# EAGLE design Camera_board (EAGLE 6.5.0)
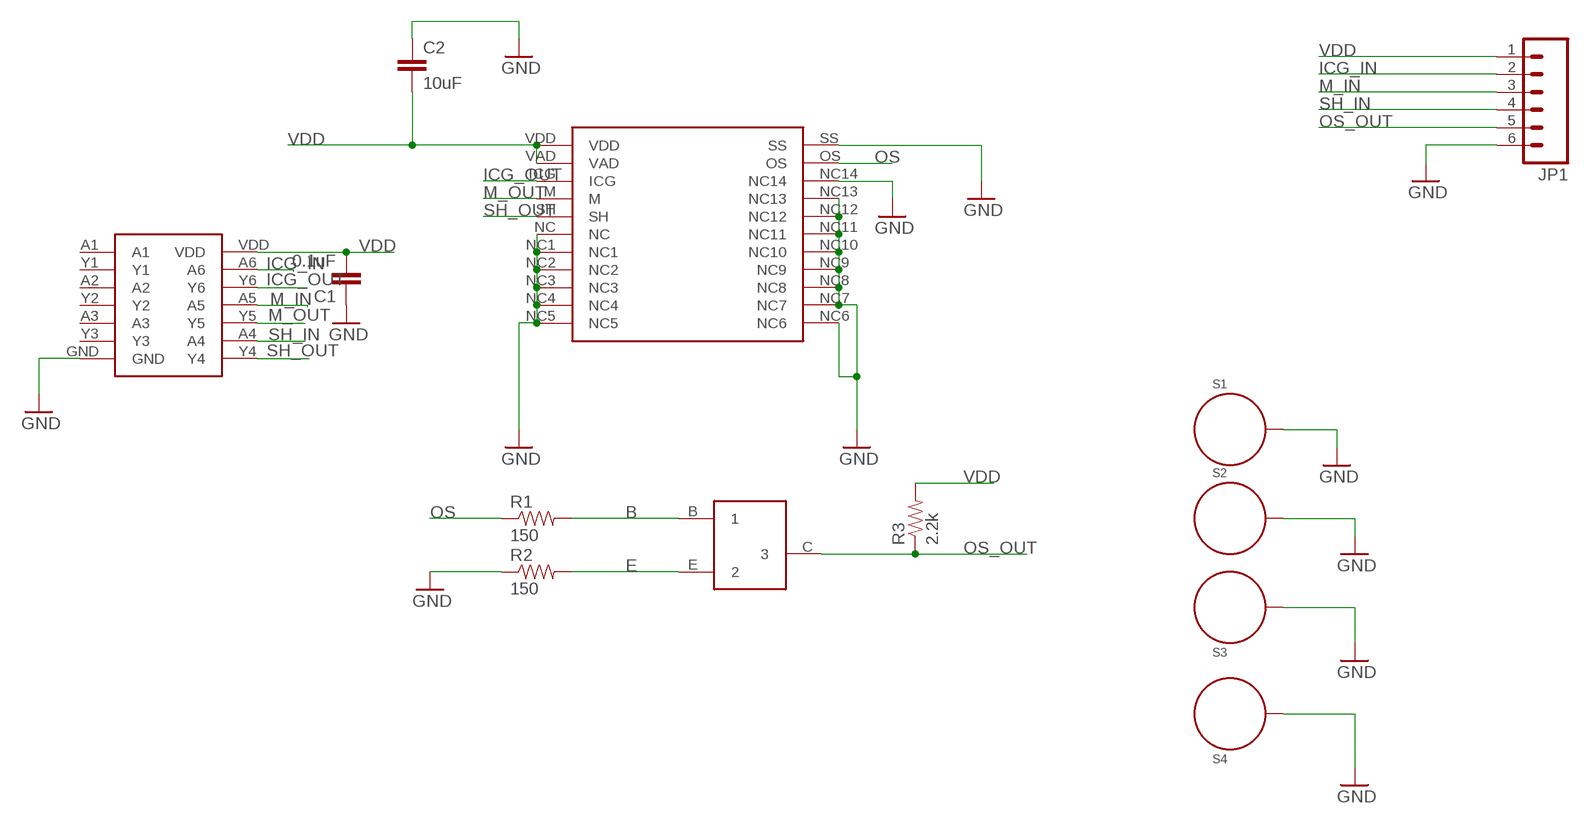
[diagram p0: schematic, sheet 1]

## Parts
C1  0.1uF  CAP1206  [1206]
C2  10uF  CAP1206  [1206]
JP1  M06POLAR  [MOLEX-1X6]
R1  150  RESISTOR1206  [1206]
R2  150  RESISTOR1206  [1206]
R3  2.2k  RESISTOR1206  [1206]
S1  STANDOFF_ELECTRICAL  [STANDOFF-ELECTRICAL]
S2  STANDOFF_ELECTRICAL  [STANDOFF-ELECTRICAL]
S3  STANDOFF_ELECTRICAL  [STANDOFF-ELECTRICAL]
S4  STANDOFF_ELECTRICAL  [STANDOFF-ELECTRICAL]
U$1  TRANSISTOR  [SOT23-BEC]
U$2  CCDCAMERA  [CCDCAMERA]
U$3  CMOS_HEX_INVERTER  [CMOS_HEX_INVERTER]

## Nets
B: R1.2 U$1.B
E: R2.2 U$1.E
GND: C1.1 C2.1 JP1.6 R2.1 S1.P1 S2.P1 S3.P1 S4.P1 U$2.NC U$2.NC1 U$2.NC2 U$2.NC3 U$2.NC4 U$2.NC5 U$2.NC6 U$2.NC7 U$2.NC8 U$2.NC9 U$2.NC10 U$2.NC11 U$2.NC12 U$2.NC13 U$2.NC14 U$2.SS U$3.GND
ICG_IN: JP1.2 U$3.A6
ICG_OUT: U$2.ICG U$3.Y6
M_IN: JP1.3 U$3.A5
M_OUT: U$2.M U$3.Y5
OS: R1.1 U$2.OS
OS_OUT: JP1.5 R3.1 U$1.C
SH_IN: JP1.4 U$3.A4
SH_OUT: U$2.SH U$3.Y4
VDD: C1.2 C2.2 JP1.1 R3.2 U$2.VAD U$2.VDD U$3.VDD
Unconnected: U$3.A1 U$3.A2 U$3.A3 U$3.Y1 U$3.Y2 U$3.Y3

## Library data of the parts
C1 C2 = SparkFun-Capacitors:CAP: Capacitor Standard 0603 ceramic capacitor, and 0.1" leaded capacitor.
JP1 = SparkFun-Connectors:M06: Header 6 Standard 6-pin 0.1" header. Use with straight break away headers (SKU : PRT-00116), right angle break away headers (PRT-00553), swiss pins (PRT-00743), machine pins (PRT-00117), and female headers (PRT-00115). Molex polarized connector foot print use with SKU : PRT-08094 with associated crimp pins and housings. NOTES ON THE VARIANTS LOCK and LOCK_LONGPADS... This footprint was designed to help hold the alignment of a through-hole component (i.e. 6-pin header) while soldering it into place. You may notice that each hole has been shifted either up or down by 0.005 of an inch from it's more standard position (which is a perfectly straight line). This slight alteration caused the pins (the squares in the middle) to touch the edges of the holes. Because they are alternating, it causes a "brace" to hold the component in place. 0.005 has proven to be the perfect amount of "off-center" position when using our standard breakaway headers. Although looks a little odd when you look at the bare footprint, once you have a header in there, the alteration is very hard to notice. Also,if you push a header all the way into place, it is covered up entirely on the bottom side. This idea of altering the position of holes to aid alignment will be further integrated into the Sparkfun Library for other footprints. It can help hold any component with 3 or more connection pins.
R1-R3 = SparkFun-Resistors:RESISTOR: Resistor Basic schematic elements and footprints for 0603, 1206, and PTH resistors.
S1-S4 = SparkFun-Electromechanical:STANDOFF_ELECTRICAL: A standoff intended to be an electrically connected point. Pad size and stop size allow for a #4 Phillips pan screw head to make a solid connection to the board.
U$1 = SCIENCE_BOARD:TRANSISTOR
U$2 = SCIENCE_BOARD:CCDCAMERA
U$3 = SCIENCE_BOARD:CMOS_HEX_INVERTER

## Board
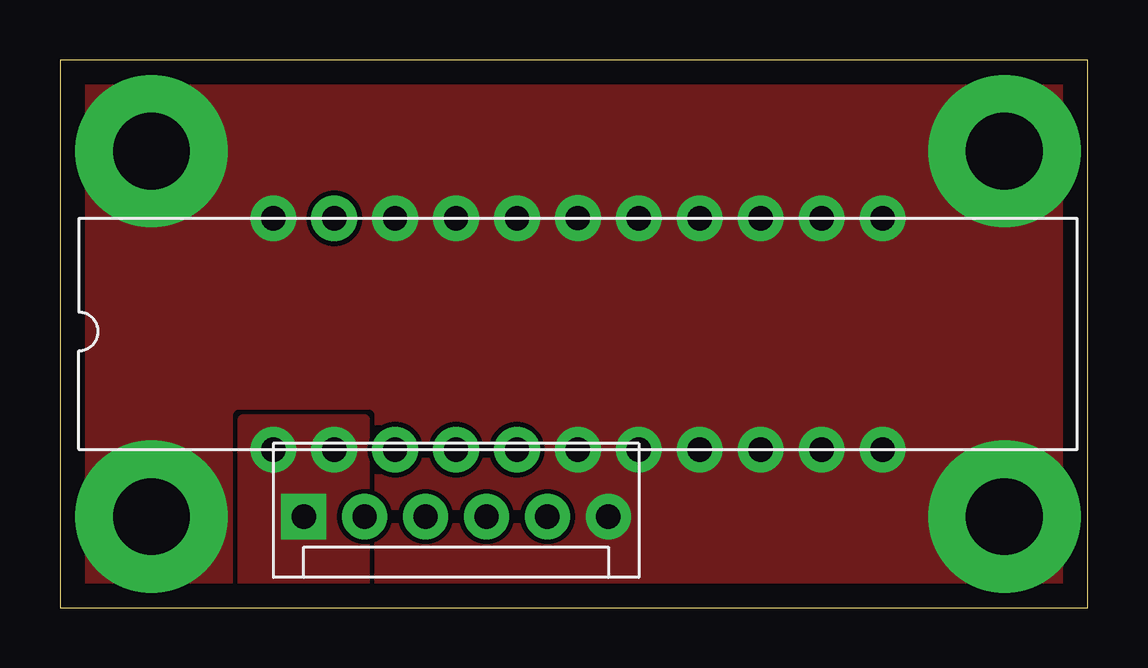
[diagram p1: board, top side]
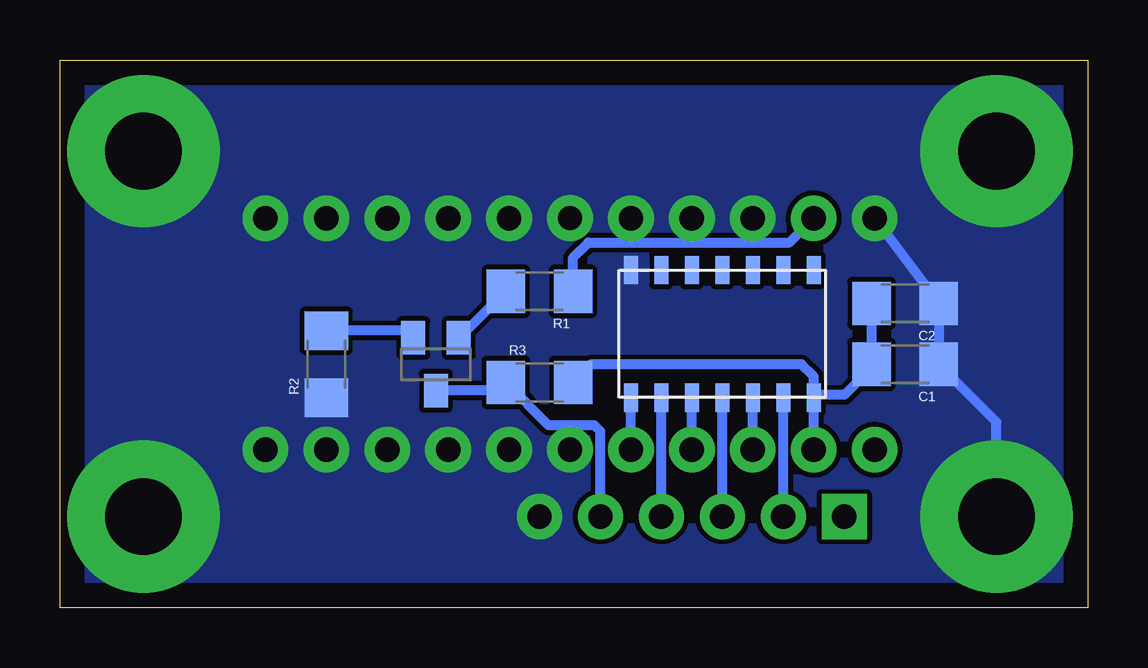
[diagram p2: board, bottom side, seen from below]

Size 42.85 x 22.85 mm. Coordinates in mm from the lower left corner, seen from the top.
Outline: 0,0 42.85,0 42.85,22.85 0,22.85 0,0
Copper layers (1*16): Top 0.035mm / dielectric 1.5mm / Bottom 0.035mm
Design rules "default": minimum track width 10mil, minimum drill 24mil, track to track 8mil, track to pad 8mil, pad to pad 8mil, via to via 8mil, smd to smd 8mil, copper to edge 40mil, drill to drill 8mil, minimum pad ring 10mil, minimum via ring 8mil, stop-mask expansion 4mil, vias tented up to drill 0mil, thermal gap 10mil

### Footprints (pad centres in the part's own frame; a part is rotated, then mirrored left to right if it is on the bottom)
1206 = smd 1.6 x 1.8: 1 -1.4,0; 2 1.4,0
MOLEX-1X6 = drill 1.016 pad 1.88 square: 1 0,0 | drill 1.016 pad 1.88: 2 2.54,0; 3 5.08,0; 4 7.62,0; 5 10.16,0; 6 12.7,0
STANDOFF-ELECTRICAL = drill 3.2 pad 6.35: P1 0,0
SOT23-BEC = smd 1 x 1.4: B -0.95,-1.1; C 0,1.1; E 0.95,-1.1
CCDCAMERA = drill 1.016 pad 1.905: ICG -7.62,-4.825; M -5.08,-4.825; NC 0,-4.825; NC1 2.54,-4.825; NC2 5.08,-4.825; NC3 7.62,-4.825; NC4 10.16,-4.825; NC5 12.7,-4.825; NC6 12.7,4.82; NC7 10.16,4.82; NC8 7.62,4.82; NC9 5.08,4.82; NC10 2.54,4.82; NC11 0,4.825; NC12 -2.54,4.82; NC13 -5.08,4.82; NC14 -7.62,4.82; OS -10.16,4.82; OS1 -10.16,4.82; SH -2.54,-4.825; SS -12.7,4.82; VAD -10.16,-4.825; VDD -12.7,-4.825
CMOS_HEX_INVERTER = smd 1.18 x 0.58: A1 -2.66,3.81; A2 -2.66,1.27; A3 -2.66,-1.27; A4 2.66,-2.54; A5 2.66,0; A6 2.66,2.54; GND -2.66,-3.81; VDD 2.66,3.81; Y1 -2.66,2.54; Y2 -2.66,0; Y3 -2.66,-2.54; Y4 2.66,-3.81; Y5 2.66,-1.27; Y6 2.66,1.27

### Placement (x,y rotation side)
C1  7.62,10.16 180 bottom
C2  7.62,12.7 180 bottom
JP1  10.16,3.81 0 top
R1  22.86,13.21 180 bottom
R2  31.75,10.16 90 bottom
R3  22.86,9.4 0 bottom
S1  39.37,3.81 0 top
S2  39.37,19.05 0 top
S3  3.81,19.05 0 top
S4  3.81,3.81 0 top
U$1  27.18,10.16 180 bottom
U$2  21.59,11.43 0 top
U$3  15.24,11.43 270 bottom

### Tracks (layer width: path | path; a pad name or v marks a point on that pad's centre or on a via)
B
  Bottom 0.406: U$1.B 26.21,11.26 R1.2
E
  Bottom 0.406: U$1.E 28.43,11.56 R2.2
GND
  Bottom 0.406: U$2.SS C2.1 C1.1 3.81,7.75 S4.P1
  pour Bottom (no thermals): 0,24.13 44.45,24.13 44.45,-1.27 0,-1.27
  pour Top (rank 2, no thermals): -1.27,25.4 45.72,25.4 45.72,-2.54 -1.27,-2.54
ICG_IN
  Bottom 0.406: JP1.2 U$3.A6
ICG_OUT
  Bottom 0.406: U$2.ICG U$3.Y6
M_IN
  Bottom 0.406: JP1.3 U$3.A5
M_OUT
  Bottom 0.406: U$2.M U$3.Y5
OS
  Bottom 0.406: R1.1 21.46,14.61 20.83,15.24 12.44,15.24 U$2.OS
OS_OUT
  Bottom 0.406: U$1.C 24.6,9.06 R3.1 22.48,7.62 20.57,7.62 20.32,7.37 JP1.5
SH_IN
  Bottom 0.406: JP1.4 U$3.A4
SH_OUT
  Bottom 0.406: U$2.SH U$3.Y4
VDD
  Bottom 0.406: U$2.VAD U$3.VDD | C2.2 C1.2 9.02,10.03 10.16,8.89 11.43,8.89 U$3.VDD | 11.31,8.89 U$3.VDD | U$3.VDD 11.43,9.65 11.94,10.16 20.7,10.16 R3.2
  pour Top (no thermals): 7.62,7.87 12.7,7.87 12.7,0 7.62,0